# EAGLE design naked mega 4 rev1 (EAGLE 9.6.2)
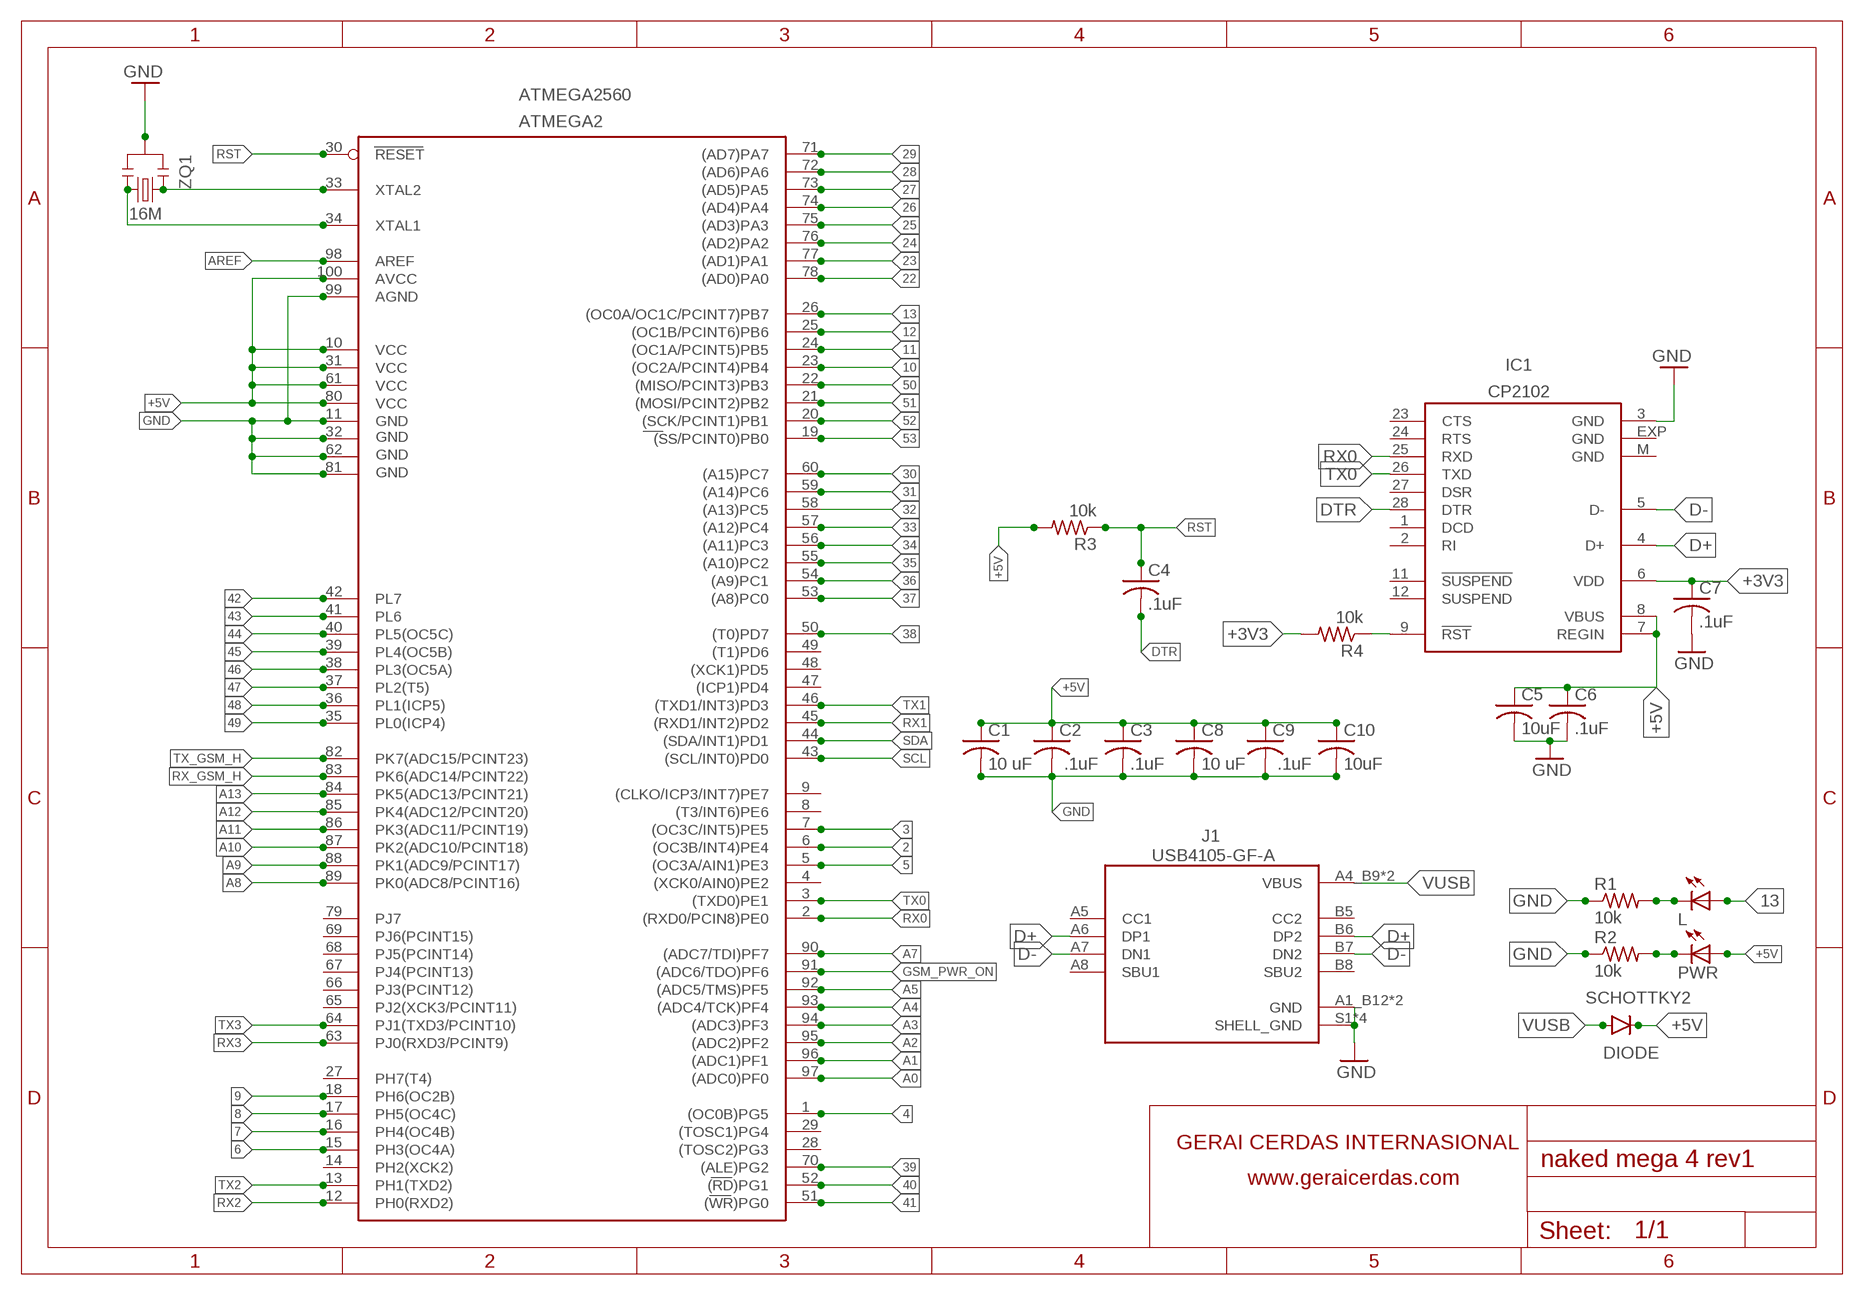
[diagram p0: schematic, sheet 1]

## Parts
ATMEGA2  ATMEGA2560  [TQFP100]
C1  10 uF  CAPACITOR-SMD-0805  [SMD-0805]
C2  .1uF  CAPACITOR-SMD-0805  [SMD-0805]
C3  .1uF  CAPACITOR-SMD-0805  [SMD-0805]
C4  .1uF  CAPACITOR-SMD-0805  [SMD-0805]
C5  10uF  CAPACITOR-SMD-0805  [SMD-0805]
C6  .1uF  CAPACITOR-SMD-0805  [SMD-0805]
C7  .1uF  CAPACITOR-SMD-0805  [SMD-0805]
C8  10 uF  CAPACITOR-SMD-0805  [SMD-0805]
C9  .1uF  CAPACITOR-SMD-0805  [SMD-0805]
C10  10uF  CAPACITOR-SMD-0805  [SMD-0805]
IC1  CP2102  [MLP28]
J1  USB4105-GF-A  [GCT_USB4105-GF-A]
L  L  LED-SMD-0805  [SMD-0805-LED]
PWR  L  LED-SMD-0805  [SMD-0805-LED]
R1  10k  RESISTOR-SMD-0805  [SMD-0805]
R2  10k  RESISTOR-SMD-0805  [SMD-0805]
R3  10k  RESISTOR-SMD-0805  [SMD-0805]
R4  10k  RESISTOR-SMD-0805  [SMD-0805]
SCHOTTKY2  DIODE  [SOD-323]
U$1  FRAME  [A4-HOR]
ZQ1  16M  RESONATORSMD-CSTCEXX  [CSTCE*]

## Nets
2: ATMEGA2.6((OC3B/INT4)PE4)
3: ATMEGA2.7((OC3C/INT5)PE5)
4: ATMEGA2.1((OC0B)PG5)
5: ATMEGA2.5((OC3A/AIN1)PE3)
6: ATMEGA2.15(PH3(OC4A))
7: ATMEGA2.16(PH4(OC4B))
8: ATMEGA2.17(PH5(OC4C))
9: ATMEGA2.18(PH6(OC2B))
10: ATMEGA2.23((OC2A/PCINT4)PB4)
11: ATMEGA2.24((OC1A/PCINT5)PB5)
12: ATMEGA2.25((OC1B/PCINT6)PB6)
13: ATMEGA2.26((OC0A/OC1C/PCINT7)PB7) L.1(A)
22: ATMEGA2.78((AD0)PA0)
23: ATMEGA2.77((AD1)PA1)
24: ATMEGA2.76((AD2)PA2)
25: ATMEGA2.75((AD3)PA3)
26: ATMEGA2.74((AD4)PA4)
27: ATMEGA2.73((AD5)PA5)
28: ATMEGA2.72((AD6)PA6)
29: ATMEGA2.71((AD7)PA7)
30: ATMEGA2.60((A15)PC7)
31: ATMEGA2.59((A14)PC6)
32: ATMEGA2.58((A13)PC5)
33: ATMEGA2.57((A12)PC4)
34: ATMEGA2.56((A11)PC3)
35: ATMEGA2.55((A10)PC2)
36: ATMEGA2.54((A9)PC1)
37: ATMEGA2.53((A8)PC0)
38: ATMEGA2.50((T0)PD7)
39: ATMEGA2.70((ALE)PG2)
40: ATMEGA2.52((RD)PG1)
41: ATMEGA2.51((WR)PG0)
42: ATMEGA2.42(PL7)
43: ATMEGA2.41(PL6)
44: ATMEGA2.40(PL5(OC5C))
45: ATMEGA2.39(PL4(OC5B))
46: ATMEGA2.38(PL3(OC5A))
47: ATMEGA2.37(PL2(T5))
48: ATMEGA2.36(PL1(ICP5))
49: ATMEGA2.35(PL0(ICP4))
50: ATMEGA2.22((MISO/PCINT3)PB3)
51: ATMEGA2.21((MOSI/PCINT2)PB2)
52: ATMEGA2.20((SCK/PCINT1)PB1)
53: ATMEGA2.19((SS/PCINT0)PB0)
+3V3: C7.1 IC1.6(VDD) R4.2
+5V: ATMEGA2.10(VCC) ATMEGA2.31(VCC1) ATMEGA2.61(VCC2) ATMEGA2.80(VCC3) ATMEGA2.100(AVCC) C1.1 C2.1 C3.1 C5.1 C6.1 C8.1 C9.1 C10.1 IC1.7(REGIN) IC1.8(VBUS) PWR.1(A) R3.2 SCHOTTKY2.C
A0: ATMEGA2.97((ADC0)PF0)
A1: ATMEGA2.96((ADC1)PF1)
A2: ATMEGA2.95((ADC2)PF2)
A3: ATMEGA2.94((ADC3)PF3)
A4: ATMEGA2.93((ADC4/TCK)PF4)
A5: ATMEGA2.92((ADC5/TMS)PF5)
A7: ATMEGA2.90((ADC7/TDI)PF7)
A8: ATMEGA2.89(PK0(ADC8/PCINT16))
A9: ATMEGA2.88(PK1(ADC9/PCINT17))
A10: ATMEGA2.87(PK2(ADC10/PCINT18))
A11: ATMEGA2.86(PK3(ADC11/PCINT19))
A12: ATMEGA2.85(PK4(ADC12/PCINT20))
A13: ATMEGA2.84(PK5(ADC13/PCINT21))
AREF: ATMEGA2.98(AREF)
D+: IC1.4(D+) J1.A6(DP1) J1.B6(DP2)
D-: IC1.5(D-) J1.A7(DN1) J1.B7(DN2)
DTR: C4.2 IC1.28(DTR)
GND: ATMEGA2.11(GND) ATMEGA2.32(GND1) ATMEGA2.62(GND2) ATMEGA2.81(GND3) ATMEGA2.99(AGND) C1.2 C2.2 C3.2 C5.2 C6.2 C7.2 C8.2 C9.2 C10.2 IC1.3(GND) J1.A1_B12(GND) J1.B1_A12(GND) J1.S1(SHELL_GND) J1.S2(SHELL_GND) J1.S3(SHELL_GND) J1.S4(SHELL_GND) R1.1 R2.1 ZQ1.2
GSM_PWR_ON: ATMEGA2.91((ADC6/TDO)PF6)
N$1: ATMEGA2.34(XTAL1) ZQ1.3
N$2: ATMEGA2.33(XTAL2) ZQ1.1
N$3: L.2(C) R1.2
N$4: IC1.9(!RST) R4.1
N$10: PWR.2(C) R2.2
RST: ATMEGA2.30(RESET) C4.1 R3.1
RX0: ATMEGA2.2((RXD0/PCIN8)PE0) IC1.25(RXD)
RX1: ATMEGA2.45((RXD1/INT2)PD2)
RX2: ATMEGA2.12(PH0(RXD2))
RX3: ATMEGA2.63(PJ0(RXD3/PCINT9))
RX_GSM_H: ATMEGA2.83(PK6(ADC14/PCINT22))
SCL: ATMEGA2.43((SCL/INT0)PD0)
SDA: ATMEGA2.44((SDA/INT1)PD1)
TX0: ATMEGA2.3((TXD0)PE1) IC1.26(TXD)
TX1: ATMEGA2.46((TXD1/INT3)PD3)
TX2: ATMEGA2.13(PH1(TXD2))
TX3: ATMEGA2.64(PJ1(TXD3/PCINT10))
TX_GSM_H: ATMEGA2.82(PK7(ADC15/PCINT23))
VUSB: J1.A4_B9(VBUS) J1.B4_A9(VBUS) SCHOTTKY2.A
Unconnected: ATMEGA2.4((XCK0/AIN0)PE2) ATMEGA2.8((T3/INT6)PE6) ATMEGA2.9((CLKO/ICP3/INT7)PE7) ATMEGA2.14(PH2(XCK2)) ATMEGA2.27(PH7(T4)) ATMEGA2.28((TOSC2)PG3) ATMEGA2.29((TOSC1)PG4) ATMEGA2.47((ICP1)PD4) ATMEGA2.48((XCK1)PD5) ATMEGA2.49((T1)PD6) ATMEGA2.65(PJ2(XCK3/PCINT11)) ATMEGA2.66(PJ3(PCINT12)) ATMEGA2.67(PJ4(PCINT13)) ATMEGA2.68(PJ5(PCINT14)) ATMEGA2.69(PJ6(PCINT15)) ATMEGA2.79(PJ7) IC1.1(DCD) IC1.2(RI) IC1.11(!SUSPEND) IC1.12(SUSPEND) IC1.23(CTS) IC1.24(RTS) IC1.27(DSR) J1.A5(CC1) J1.A8(SBU1) J1.B5(CC2) J1.B8(SBU2)

## Power pins joined to a net without a drawn wire
GND: IC1.EXP(GND) IC1.M(GND)

## Library data of the parts
ATMEGA2 = Fuzzy:ATMEGA2560
C1-C10 = Fuzzy:CAPACITOR-SMD-0805
IC1 = byquip:CP210*: Single-Chip USB to UART Bridge Source: www.silabs.com .. CP2101.pdf / cp2102.pdf; MF: FARNELL; MPN: CP2102-GM; OC_FARNELL: 9282130; OC_NEWARK: 30K5635
J1 = USB4105-GF-A:USB4105-GF-A: USB-C (USB TYPE-C) USB 2.0 Receptacle Connector 24 (16+8 Dummy) Position Surface Mount, Right Angle; Through Hole Check availability <https://pricing.snapeda.com/parts/USB4105-GF-A/GCT/view-part?ref=eda>; AVAILABILITY: In Stock; DESCRIPTION: USB-C (USB TYPE-C) USB 2.0 Receptacle Connector 24 (16+8 Dummy) Position Surface Mount, Right Angle; Through Hole; MF: GCT; MP: USB4105-GF-A; PACKAGE: None; PRICE: None; PURCHASE-URL: https://pricing.snapeda.com/search/part/USB4105-GF-A/?ref=eda
L PWR = Fuzzy:LED-SMD-0805
R1-R4 = Fuzzy:RESISTOR-SMD-0805
SCHOTTKY2 = Fuzzy:DIODE
U$1 = geraicerdas:FRAME
ZQ1 = geraicerdas:RESONATOR

## Board
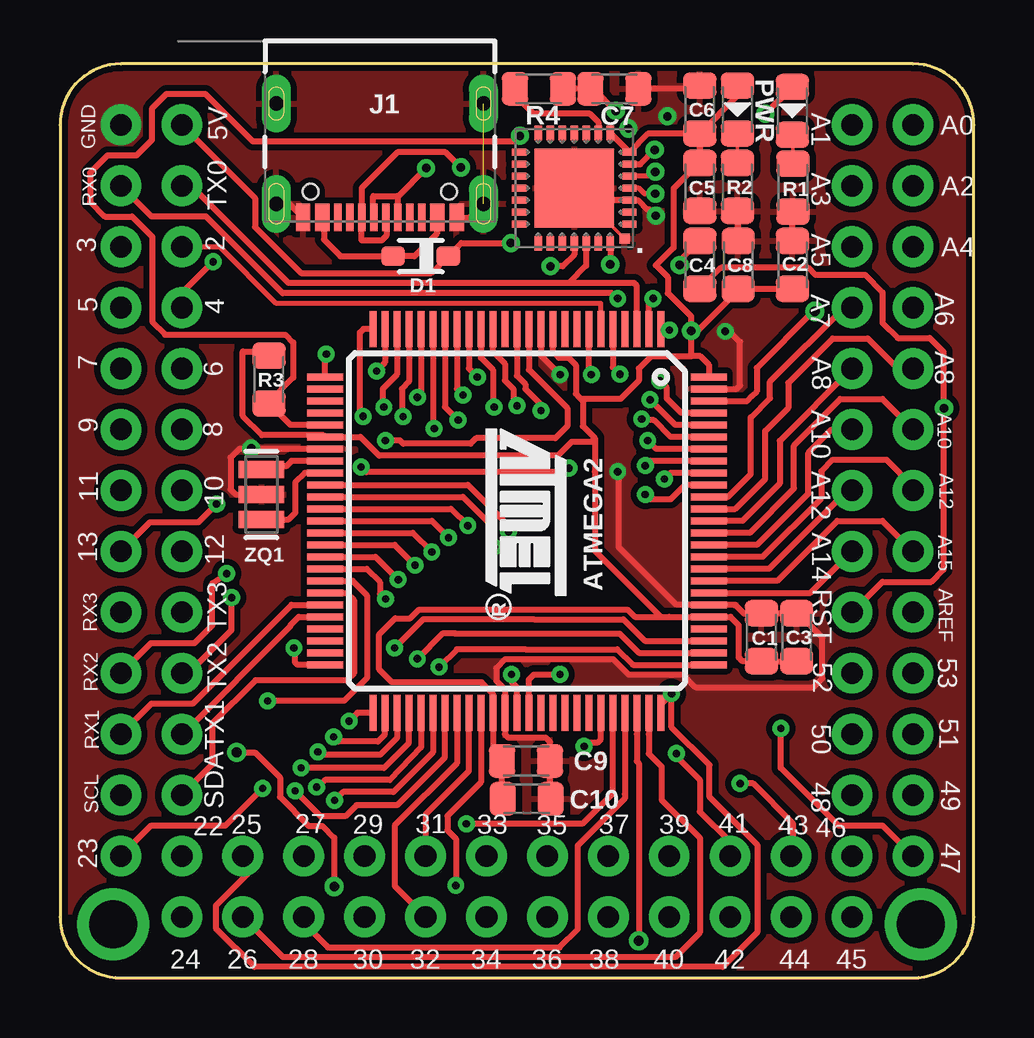
[diagram p1: board, top side]
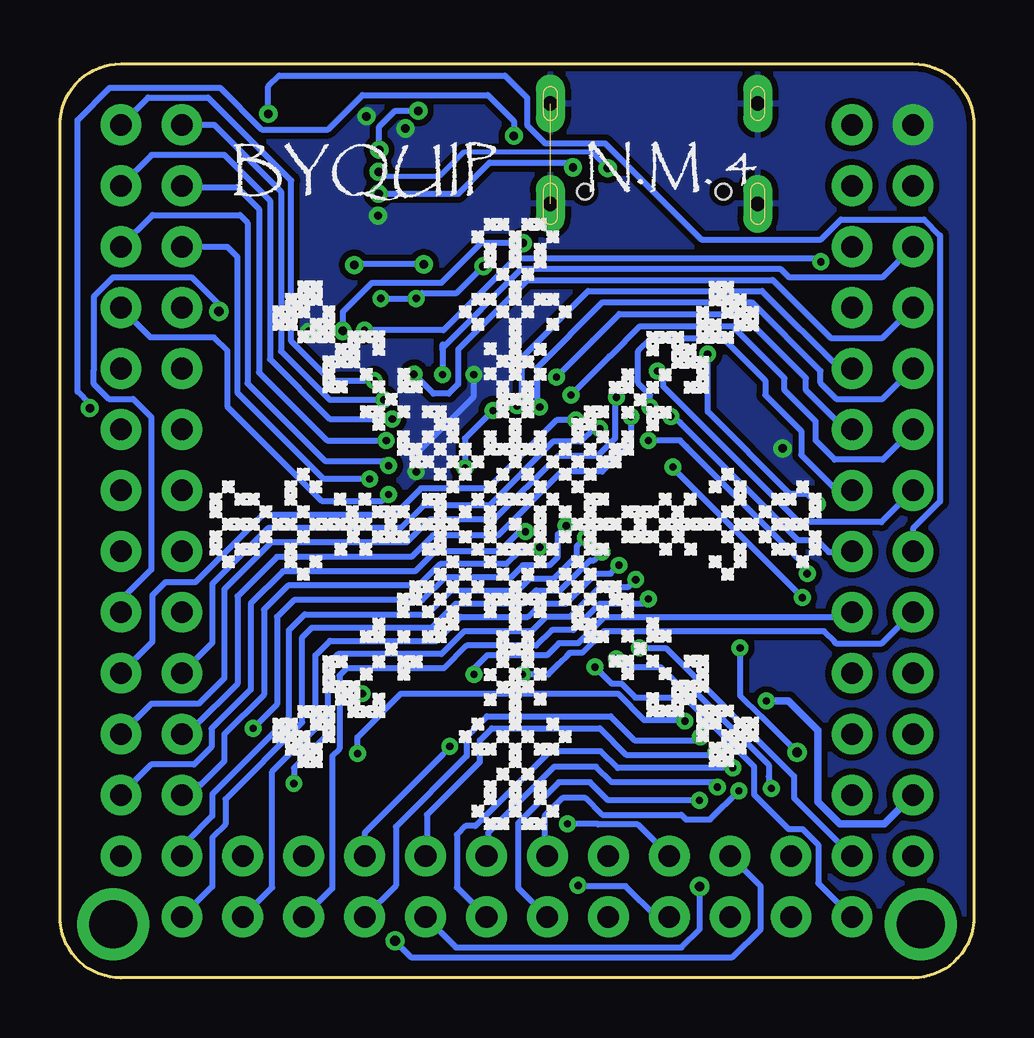
[diagram p2: board, bottom side, seen from below]

Size 38.1 x 38.1 mm. Coordinates in mm from the lower left corner, seen from the top.
Outline: 0,35.56 0,2.54 arc90 2.54,0 35.56,0 arc90 38.1,2.54 38.1,35.56 arc90 35.56,38.1 2.54,38.1 arc90 0,35.56
Copper layers (1*16): Top 0.035mm / dielectric 1.5mm / Bottom 0.035mm
Design rules "DFRobot_Eagle_Rule_v0.4": minimum track width 6mil, minimum drill 12mil, track to track 6mil, track to pad 6mil, pad to pad 6mil, via to via 6mil, smd to smd 0mil, copper to edge 10mil, drill to drill 10mil, minimum pad ring 12mil, minimum via ring 8mil, stop-mask expansion 2mil, vias tented up to drill 25mil, thermal gap 10mil

### Footprints (pad centres in the part's own frame; a part is rotated, then mirrored left to right if it is on the bottom)
TQFP100 = smd 1.5 x 0.3: 1 -8,6; 2 -8,5.5; 3 -8,5; 4 -8,4.5; 5 -8,4; 6 -8,3.5; 7 -8,3; 8 -8,2.5; 9 -8,2; 10 -8,1.5; 11 -8,1; 12 -8,0.5; 13 -8,0; 14 -8,-0.5; 15 -8,-1; 16 -8,-1.5; 17 -8,-2; 18 -8,-2.5; 19 -8,-3; 20 -8,-3.5; 21 -8,-4; 22 -8,-4.5; 23 -8,-5; 24 -8,-5.5; 25 -8,-6; 51 8,-6; 52 8,-5.5; 53 8,-5; 54 8,-4.5; 55 8,-4; 56 8,-3.5; 57 8,-3; 58 8,-2.5; 59 8,-2; 60 8,-1.5; 61 8,-1; 62 8,-0.5; 63 8,0; 64 8,0.5; 65 8,1; 66 8,1.5; 67 8,2; 68 8,2.5; 69 8,3; 70 8,3.5; 71 8,4; 72 8,4.5; 73 8,5; 74 8,5.5; 75 8,6 | smd 0.3 x 1.5: 26 -6,-8; 27 -5.5,-8; 28 -5,-8; 29 -4.5,-8; 30 -4,-8; 31 -3.5,-8; 32 -3,-8; 33 -2.5,-8; 34 -2,-8; 35 -1.5,-8; 36 -1,-8; 37 -0.5,-8; 38 0,-8; 39 0.5,-8; 40 1,-8; 41 1.5,-8; 42 2,-8; 43 2.5,-8; 44 3,-8; 45 3.5,-8; 46 4,-8; 47 4.5,-8; 48 5,-8; 49 5.5,-8; 50 6,-8; 76 6,8; 77 5.5,8; 78 5,8; 79 4.5,8; 80 4,8; 81 3.5,8; 82 3,8; 83 2.5,8; 84 2,8; 85 1.5,8; 86 1,8; 87 0.5,8; 88 0,8; 89 -0.5,8; 90 -1,8; 91 -1.5,8; 92 -2,8; 93 -2.5,8; 94 -3,8; 95 -3.5,8; 96 -4,8; 97 -4.5,8; 98 -5,8; 99 -5.5,8; 100 -6,8
SMD-0805 = smd 1.1 x 1.4: 1 -1,0; 2 1,0
MLP28 = smd 0.6 x 0.3: 1 -2.3,1.5; 2 -2.3,1; 3 -2.3,0.5; 4 -2.3,0; 5 -2.3,-0.5; 6 -2.3,-1; 7 -2.3,-1.5; 15 2.3,-1.5; 16 2.3,-1; 17 2.3,-0.5; 18 2.3,0; 19 2.3,0.5; 20 2.3,1; 21 2.3,1.5 | smd 0.3 x 0.6: 8 -1.5,-2.3; 9 -1,-2.3; 10 -0.5,-2.3; 11 0,-2.3; 12 0.5,-2.3; 13 1,-2.3; 14 1.5,-2.3; 22 1.5,2.3; 23 1,2.3; 24 0.5,2.3; 25 0,2.3; 26 -0.5,2.3; 27 -1,2.3; 28 -1.5,2.3 | smd 3.3 x 3.3: EXP 0,0 | smd 0.435 x 0.435: M -2.103,2.103
GCT_USB4105-GF-A = smd 0.6 x 1.15: A1_B12 -3.2,4.755; A4_B9 -2.4,4.755; B1_A12 3.2,4.755; B4_A9 2.4,4.755 | smd 0.3 x 1.15: A5 -1.25,4.755; A6 -0.25,4.755; A7 0.25,4.755; A8 1.25,4.755; B5 1.75,4.755; B6 0.75,4.755; B7 -0.75,4.755; B8 -1.75,4.755 | drill 0.6 pad 1.05 long: S1 -4.32,4.18; S4 4.32,4.18 | drill 0.6 pad 1 long: S2 -4.32,0; S3 4.32,0 | hole 0.65: 2.89,3.68; -2.89,3.68
SMD-0805-LED = smd 1.1 x 1.4: 1 -1,0; 2 1,0
SOD-323 = smd 1 x 0.8: A 1.15,0; C -1.15,0
CSTCE* = smd 0.7 x 1.905: 1 -1.041,0; 2 0,0; 3 1.041,0

### Placement (x,y rotation side)
ATMEGA2  19.05,19.05 270 top
C1  29.24,14.2 90 top
C2  30.54,29.72 90 top
C3  30.71,14.2 90 top
C4  26.67,29.72 90 top
C5  26.67,32.97 270 top
C6  26.67,36.2 90 top
C7  23.11,37.06 0 top
C8  28.27,29.72 90 top
C9  19.43,9.04 0 top
C10  19.46,7.47 0 top
IC1  21.44,32.92 180 top
J1  13.33,36.45 180 top
L  30.53,36.14 270 top
PWR  28.24,36.2 270 top
R1  30.56,32.94 90 top
R2  28.24,32.97 90 top
R3  8.71,24.94 90 top
R4  19.96,37.06 0 top
SCHOTTKY2  15.04,30.09 180 top
U$1  -0.25,-0.13 0 top
U$4  [RUBIZHNE-VYSHYVANKA-LOGO]  6.38,6.17 0 top
ZQ1  8.4,20.15 270 top

### Tracks (layer width: path | path; a pad name or v marks a point on that pad's centre or on a via)
2  (via drill 0.9 pad 1.7)
  Top 0.2: ATMEGA2.6 22.55,28.11 9.02,28.11 6.65,30.48 v5.08,30.48
3  (via drill 0.3 pad 0.5, 0.9 pad 1.7)
  Top 0.25: ATMEGA2.7 22.05,25.25 v22.15,25.15
  Bottom 0.25: 7.7,29.2 3.82,29.2 v2.54,30.48 | 22.05,25.25 v22.15,25.15 22.15,26.16 22.15,26.4
  Bottom 0.254: 7.7,29.2 8.04,29.54 18.87,29.54 22.15,26.26 22.15,26.16
4  (via drill 0.3 pad 0.5, 0.9 pad 1.7)
  Top 0.25: v25.4,27 25.1,27 ATMEGA2.1
  Top 0.254: v5.08,27.94 5.08,28.54 v6.39,29.85
  Bottom 0.25: v25.4,27 22.11,27 19.14,29.97
  Bottom 0.254: 19.14,29.97 6.39,29.97 v6.39,29.85
5  (via drill 0.3 pad 0.5, 0.9 pad 1.7)
  Top 0.25: ATMEGA2.5 23.05,26.05
  Top 0.254: 23.05,26.05 23.05,25.46 v23.35,25.16
  Bottom 0.25: 21.9,24.35 21.5,24.75 21.5,26.2 18.61,29.09 8.39,29.09 5.97,26.67 3.81,26.67 v2.54,27.94
  Bottom 0.254: 21.9,24.35 22.53,24.35 v23.35,25.16
6  (via drill 0.3 pad 0.5, 0.9 pad 1.7)
  Top 0.25: v19.05,23.85 18.9,24 18.9,24.55 18.55,24.9 18.55,25.6 18.05,26.1 ATMEGA2.15
  Bottom 0.25: v5.08,25.4 5.6,25.4 8.83,28.63 16.08,28.63 18.85,25.86 18.85,24.05 v19.05,23.85
7  (via drill 0.3 pad 0.5, 0.9 pad 1.7)
  Top 0.25: ATMEGA2.16 17.55,25.85 18.05,25.35 18.05,23.85 v18.1,23.8
  Bottom 0.25: v18.1,23.8 18.2,23.9 18.2,25.45 15.48,28.17 9.27,28.17 6.4,25.3 6.4,24.8 5.73,24.13 3.81,24.13 v2.54,25.4
8  (via drill 0.3 pad 0.5, 0.9 pad 1.7)
  Top 0.25: ATMEGA2.17 17.05,25.4 v17.4,25.05
  Bottom 0.25: v5.08,22.86 5.36,22.86 7,24.5 7,25 9.68,27.68 14.78,27.68 15.89,26.57 15.89,26.56 v17.4,25.05
9  (via drill 0.3 pad 0.5, 0.9 pad 1.7)
  Top 0.25: ATMEGA2.18 16.55,24.55 v16.8,24.3
  Bottom 0.25: v16.8,24.3 15.2,25.9 15.18,25.9 13.91,27.17 10.07,27.17 7.9,25 7.9,24.5 6.6,23.2 6.6,22.4 5.8,21.6 3.8,21.6 v2.54,22.86
10  (via drill 0.3 pad 0.5, 0.9 pad 1.7)
  Top 0.25: ATMEGA2.23 14.05,25.15 13.45,24.55 13.45,23.85 v13.5,23.8
  Bottom 0.25: v13.5,23.8 13.5,24.3 14,24.8 14,26.12 13.45,26.67 10.47,26.67 8.7,24.9 8.7,24.3 7.2,22.8 7.2,21.8 5.7,20.3 5.1,20.3 v5.08,20.32
11  (via drill 0.3 pad 0.5, 0.9 pad 1.7)
  Top 0.25: ATMEGA2.24 13.55,25.65 v13.2,25.3 13.15,25.35
  Bottom 0.25: v13.2,25.3 12.95,25.05 12.95,24.65 7.3,19 3.86,19 v2.54,20.32
12  (via drill 0.3 pad 0.5, 0.9 pad 1.7)
  Top 0.25: ATMEGA2.25 12.65,27.05 12.5,26.9 12.5,23.3
  Top 0.254: v12.64,23.41 12.5,23.29 12.5,23.3
  Bottom 0.25: 12.05,22.95 7.35,18.25 6.55,18.25 6.05,17.75 5.11,17.75 v5.08,17.78
  Bottom 0.254: 12.05,22.95 12.25,23.15 v12.64,23.41
13  (via drill 0.3 pad 0.5, 0.35, 0.9 pad 1.7)
  Top 0.25: v2.54,17.78 3.76,19 5.77,19 v6.52,19.75 | ATMEGA2.26 11.05,25.95 v11.1,26 | L.1 30.53,37.14 v29.41,36.02
  Bottom 0.25: 11.2,25.9 v11.1,26 11.1,23.6 7.7,20.2 6.97,20.2 v6.52,19.75 | v29.41,36.02 29.41,37.16 28.96,37.62 19.56,37.62 18.63,36.69 18.63,35.55 17.88,34.79 15.38,34.79 11.36,30.78 6.37,30.78 5.55,31.61 2.07,31.61 1.41,30.95 1.41,19.85 2.54,18.73 v2.54,17.78
22  (via drill 0.3 pad 0.5, 0.9 pad 1.7)
  Top 0.25: 24.38,14.05 ATMEGA2.78 | 19.75,14.95 15.65,14.95
  Top 0.254: 19.75,14.95 23.48,14.95 24.38,14.05 | 15.65,14.95 15.14,14.95 v13.94,13.75
  Bottom 0.25: v13.94,13.75 12.85,13.75 | 7.5,8.38 7.5,7.5 v5.08,5.08
  Bottom 0.254: 12.85,13.75 7.5,8.4 7.5,8.38
23  (via drill 0.3 pad 0.5, 0.9 pad 1.7)
  Top 0.25: 24.13,13.55 ATMEGA2.77 | 16.45,14.35 16.51,14.35 19.5,14.35 | v2.54,5.08 3.81,6.35 6.9,6.35 v8.45,7.9
  Top 0.254: 19.5,14.35 23.33,14.35 24.13,13.55 | 16.51,14.35 15.94,14.35 v14.9,13.3
  Bottom 0.25: 8.55,8.38 8.55,8 v8.45,7.9
  Bottom 0.254: 8.55,8.38 8.55,8.87 11.77,12.09 12.19,12.09 13.05,12.95 14.54,12.95 v14.9,13.3
24  (via drill 0.3 pad 0.5, 0.9 pad 1.7)
  Top 0.25: 23.88,13.05 ATMEGA2.76 | 19.4,13.7 16.55,13.7
  Top 0.254: 19.4,13.7 23.23,13.7 23.88,13.05 | 16.55,13.7 16.54,13.7 v15.8,12.95
  Bottom 0.254: v5.08,2.54 6.49,3.95 6.49,5.55 7.15,6.21 7.73,6.21 9.17,7.64 9.17,8.81 11.94,11.58 11.94,11.68 14.11,11.68 14.68,12.25 15.1,12.25 v15.8,12.95
25  (via drill 0.3 pad 0.5, 0.9 pad 1.7)
  Top 0.25: ATMEGA2.75 25.05,11.4 v25.5,11.85
  Top 0.254: v25.5,11.85 25.5,10.45 27.07,8.87 27.07,7.54 29.07,5.55 29.07,1.89 27.63,0.46 8.11,0.46 6.49,2.07 6.49,3.01 8.09,4.61 v7.62,5.08
26  (via drill 0.9 pad 1.7)
  Top 0.25: ATMEGA2.74 24.55,10.16
  Top 0.254: v7.62,2.54 9.3,0.86 25.65,0.86 26.67,1.88 26.67,5.84 25.08,7.43 25.08,8.81 24.55,9.34 24.55,10.16
27  (via drill 0.4, 0.9 pad 1.7)
  Top 0.25: ATMEGA2.73 24.05,10.16
  Top 0.254: v24.13,1.55 24.13,8.95 24.05,9.03 24.05,10.16
  Bottom 0.254: 24.13,1.52 v24.13,1.55 | 23.88,1.27 arc90 24.13,1.52 | 23.88,1.27 24.13,1.52 | 23.88,1.27 23.47,0.86 10.06,0.86 8.89,2.03 8.89,3.81 v10.16,5.08
28  (via drill 0.9 pad 1.7)
  Top 0.25: ATMEGA2.72 23.55,7.66 23.55,7.48
  Top 0.254: v10.16,2.54 10.16,2.29 11.18,1.27 20.83,1.27 21.59,2.03 21.59,5.52 23.55,7.48
29  (via drill 0.3 pad 0.5, 0.9 pad 1.7)
  Top 0.25: ATMEGA2.71 23.05,7.69 21.78,6.42 v16.94,6.42
  Bottom 0.254: v12.7,5.08 14.02,6.4 15.67,6.4 15.69,6.42 v16.94,6.42
30  (via drill 0.3 pad 0.5, 0.9 pad 1.7)
  Top 0.25: 16.45,3.9 v16.5,3.85 16.5,5.8 16.15,6.15 16.15,6.75 17.55,8.15 ATMEGA2.60
  Bottom 0.25: v12.7,2.54 13.24,2.54 14.52,3.82 16.47,3.82 v16.5,3.85
31  (via drill 0.9 pad 1.7)
  Top 0.25: 15.2,5.12 v15.24,5.08 15.24,6.81 17.05,8.62 ATMEGA2.59
32  (via drill 0.9 pad 1.7)
  Top 0.25: ATMEGA2.58 16.55,8.95 13.95,6.35 13.95,3.83 v15.24,2.54
33  (via drill 0.3 pad 0.5, 0.9 pad 1.7)
  Top 0.25: ATMEGA2.57 16.05,9.2 14.05,7.2 12.36,7.2 11.9,6.74 10.86,6.74 v9.8,7.8
  Bottom 0.25: v17.78,5.08 17.9,5.2 17.9,6.75 17.15,7.5 16.2,7.5 15.5,6.8 12.2,6.8 12,6.6 11,6.6 v9.8,7.8
34  (via drill 0.3 pad 0.5, 0.9 pad 1.7)
  Top 0.25: ATMEGA2.56 15.55,9.4 13.9,7.75 11.8,7.75 v11.45,7.4 11.5,7.45
  Bottom 0.25: v11.45,7.4 15.25,7.4 16,8.15 17.3,8.15 19,6.45 19,3.76 v17.78,2.54
35  (via drill 0.3 pad 0.5, 0.9 pad 1.7)
  Top 0.25: ATMEGA2.55 15.05,9.6 13.75,8.25 11.05,8.25 v10.7,7.95
  Bottom 0.25: v20.32,5.08 20.25,5.15 20.25,6.05 17.5,8.8 15.75,8.8 15.1,8.15 10.9,8.15 v10.7,7.95
36  (via drill 0.3 pad 0.5, 0.9 pad 1.7)
  Top 0.25: v10.05,8.75 13.5,8.75 14.55,9.8 ATMEGA2.54
  Bottom 0.25: v10.05,8.75 14.85,8.75 15.55,9.45 17.7,9.45 17.7,9.41 20.78,6.33 21.19,6.33 21.55,5.97 21.55,3.77 v20.32,2.54
37  (via drill 0.3 pad 0.5, 0.9 pad 1.7)
  Top 0.25: ATMEGA2.53 14.05,10 13.35,9.3 10.95,9.3 v10.75,9.42
  Bottom 0.25: v22.86,5.08 22.8,5.14 22.8,6.8 20.6,9 20.6,9.9 20.1,10.4 15.6,10.4 14.5,9.3 10.95,9.3 v10.75,9.42
38  (via drill 0.3 pad 0.5, 0.4, 0.9 pad 1.7)
  Top 0.25: ATMEGA2.50 9.9,13.05 9.8,13.15 9.8,13.7 v9.75,13.75
  Top 0.254: v7.37,9.4 8.13,9.4 9.17,8.36 9.17,7.54 10.37,6.33 10.94,6.33 11.43,5.84 v11.43,3.81
  Bottom 0.254: v7.37,9.4 8.89,10.92 8.91,10.92 9.75,11.76 v9.75,13.75 | v22.86,2.54 21.59,1.27 12.19,1.27 11.43,2.03 v11.43,3.81
39  (via drill 0.3 pad 0.5, 0.9 pad 1.7)
  Top 0.25: v21.85,9.65 22,9.8 22.4,9.8 22.55,9.95 ATMEGA2.70
  Bottom 0.25: v21.85,9.65 22.15,9.3 25.4,6.05 v25.4,5.08
40  (via drill 0.3 pad 0.5, 0.9 pad 1.7)
  Top 0.25: v11.4,10.05 11.6,9.85 13.25,9.85 13.55,10.15 ATMEGA2.52
  Bottom 0.25: v25.4,2.54 24.1,3.84 24.1,6.3 21.15,9.25 21.15,10.05 20.3,10.9 15.15,10.9 14.15,9.9 11.55,9.9 v11.4,10.05
41  (via drill 0.3 pad 0.5, 0.9 pad 1.7)
  Top 0.25: ATMEGA2.51 12.4,11.05 v12.05,10.7 | v27.94,5.08 27.94,5.66 26.67,6.93 26.67,8.26 25.7,9.23 v25.7,9.35
  Bottom 0.25: v12.05,10.7 12.1,10.75 13.75,10.75 14.85,11.85 23.88,11.85 | 25.6,9.45 v25.7,9.35
  Bottom 0.254: v25.7,9.35 25.7,10.03 23.88,11.85
42  (via drill 0.3 pad 0.5, 0.9 pad 1.7)
  Top 0.25: ATMEGA2.42 12.79,17.05 13.34,16.5 13.34,16.02 v13.57,15.79
  Bottom 0.25: v27.94,2.54 26.75,3.73 26.75,9.25 26.45,9.55 26.45,12.6 26.15,12.9 22.1,12.9 21.15,13.85 18.25,13.85 17.6,14.5 16.7,14.5 15.6,15.6 13.76,15.6 v13.57,15.79
43  (via drill 0.3 pad 0.5, 0.9 pad 1.7)
  Top 0.25: ATMEGA2.41 13.15,17.55 v14.1,16.6 14.05,16.65 | v30.48,5.08 30.55,5.15 30.55,6.45 28.9,8.1 v28.35,8.1
  Bottom 0.25: v28.35,8.1 28.35,8.75 26.95,10.15 26.95,13.05 26.5,13.5 22.2,13.5 21.25,14.45 18.45,14.45 17.85,15.05 16.85,15.05 15.6,16.3 14.4,16.3 v14.1,16.6
44  (via drill 0.3 pad 0.5, 0.9 pad 1.7)
  Top 0.25: ATMEGA2.40 13.95,18.05 v14.8,17.2 14.75,17.25
  Bottom 0.25: v14.8,17.2 15.15,16.85 15.75,16.85 17,15.6 18.05,15.6 18.6,15.05 21.4,15.05 22.4,14.05 26.85,14.05 27.45,13.45 27.45,10.4 29.25,8.6 29.25,3.77 v30.48,2.54
45  (via drill 0.3 pad 0.5, 0.9 pad 1.7)
  Top 0.25: ATMEGA2.39 14.7,18.55 v15.5,17.75
  Bottom 0.25: v33.02,2.54 31.75,3.81 31.75,5.85 31.2,6.4 31.2,7.45 28,10.65 28,14.2 27.6,14.6 22.6,14.6 21.6,15.6 18.8,15.6 18.25,16.15 17.25,16.15 16,17.4 15.85,17.4 v15.5,17.75
46  (via drill 0.3 pad 0.5, 0.9 pad 1.7)
  Top 0.25: ATMEGA2.38 15.5,19.05 v16.2,18.35
  Bottom 0.25: 32.9,5.2 v33.02,5.08 32.8,5.3 32.8,5.7 31.75,6.75 31.75,7.65 28.55,10.85 28.55,14.5 27.9,15.15 22.8,15.15 21.8,16.15 19,16.15 18.5,16.65 17.5,16.65 16.55,17.6 16.55,18 v16.2,18.35
47  (via drill 0.3 pad 0.5, 0.9 pad 1.7)
  Top 0.25: ATMEGA2.37 16.3,19.55 v17,18.85 | v35.56,5.08 34.29,6.35 32.45,6.35 30.05,8.75 v30.05,10.4
  Bottom 0.25: v30.05,10.4 29.05,11.4 29.05,15.05 28.35,15.75 23,15.75 22.05,16.7 19.3,16.7 18.8,17.2 17.7,17.2 17.35,17.55 17.35,18.5 v17,18.85
48  (via drill 0.3 pad 0.5, 0.9 pad 1.7)
  Top 0.25: ATMEGA2.36 16.8,20.05 17.95,18.9 17.95,18.1 v18.1,17.95
  Bottom 0.25: v18.1,17.95 18.25,17.8 18.95,17.8 19.5,17.25 22.25,17.25 23.15,16.35 28.6,16.35 29.6,15.35 29.6,11.8 31.25,10.15 31.25,9.03 32.24,8.04 32.6,8.04 v33.02,7.62
49  (via drill 0.3 pad 0.5, 0.9 pad 1.7)
  Top 0.25: ATMEGA2.35 17,20.55 18.45,19.1 18.45,18.85 v18.7,18.6
  Bottom 0.25: v18.7,18.6 18.95,18.6 19.75,17.8 22.45,17.8 23.3,16.95 28.8,16.95 30.15,15.6 30.15,12.02 31.78,10.39 31.78,9.62 32.51,8.89 34.29,8.89 v35.56,7.62
50  (via drill 0.3 pad 0.5, 0.9 pad 1.7)
  Top 0.25: ATMEGA2.22 14.55,24.85 14.25,24.55 14.25,23.45 v14.3,23.4
  Bottom 0.25: v14.3,23.4 14.3,22.3 15.5,21.1 17.2,21.1 19.85,18.45 22.55,18.45 23.45,17.55 29.05,17.55 30.7,15.9 30.7,12.26 32.5,10.46 32.72,10.46 v33.02,10.16
51  (via drill 0.3 pad 0.5, 0.9 pad 1.7)
  Top 0.25: 15,24.3 v14.9,24.2 15.05,24.35 ATMEGA2.21
  Bottom 0.25: 35.54,10.16 v35.56,10.16 34.29,11.43 34.28,11.42 32.32,11.42 31.25,12.49 31.25,16.2 29.3,18.15 23.65,18.15 22.7,19.1 20,19.1 17.35,21.75 15.7,21.75 14.95,22.5 14.95,24.15 v14.9,24.2
52  (via drill 0.3 pad 0.5, 0.9 pad 1.7)
  Top 0.25: 15.5,23 v15.6,22.9 15.55,22.95 ATMEGA2.20
  Bottom 0.25: v15.6,22.9 15.85,22.9 16.4,22.35 17.55,22.35 20.2,19.7 22.95,19.7 23.9,18.75 29.43,18.75 31.75,16.43 31.75,13.97 v33.02,12.7
53  (via drill 0.3 pad 0.5, 0.9 pad 1.7)
  Top 0.25: ATMEGA2.19 16.05,23.8 v16.6,23.25
  Bottom 0.25: v16.6,23.25 17.4,23.25 20.25,20.4 23.05,20.4 24.15,19.3 29.66,19.3 32.47,16.49 33.71,16.49 34.25,15.95 34.25,14.01 v35.56,12.7
+3V3  (via drill 0.35)
  Top 0.25: R4.2 C7.1 22.25,37.06 v23.16,36.14 | IC1.6 24.19,33.92 v24.79,34.52
  Bottom 0.25: v23.16,36.14 24.13,36.14 24.79,35.48 v24.79,34.52
+5V  (via drill 0.35, 0.9 pad 1.7)
  Top 0.152: 18.05,9.42 C9.1
  Top 0.25: 25.4,15.05 25.05,15.05 22.3,17.8 22.3,21.1 | 20.55,26.1 20.8,25.85 21.2,25.85 21.5,25.55 21.5,24.35 21.65,24.2 21.8,24.05 21.8,23 22,22.8 | 27.95,15.05 28.3,14.7 28.3,13.35 28.45,13.2 C1.1 C3.1 | 27.05,25.56 26.7,25.91 26.32,25.91 26.31,25.91 v26.31,26.98 | 5.1,35.54 v5.08,35.56 8.13,32.51 8.13,31.3 10.04,29.39 15.49,29.39 SCHOTTKY2.C 16.73,30.63 v18.8,30.63 | ATMEGA2.61 18.05,9.42 | C5.1 C6.1 28.24,36.77 PWR.1 | IC1.8 IC1.7 24.5,35.18 26.67,35.18 C5.1 | v26.31,26.98 26.59,26.98 28.27,28.65 C8.1 C2.1 | ATMEGA2.31 10.98,22.62 8.43,22.62 7.62,23.43 7.62,26.11 8.54,26.11 R3.2 | v26.31,26.98 26.31,27.57 25.34,28.54 25.34,29.21 24.84,29.7 25.58,30.44 25.58,32.9 26.64,33.97 C5.1 | C10.1 18.43,7.49 C9.1
  Top 0.254: 22.3,22.5 22,22.8 | 22.3,22.5 22.3,21.1 | 21.65,24.2 21.72,24.13 23.37,24.13 24.13,24.89 24.13,25.4 24.64,25.91 26.31,25.91 | 22.3,22.5 22.15,22.35 21.34,22.35 20.76,21.77 13.3,21.77 12.53,22.55 ATMEGA2.31 | 20.55,26.1 ATMEGA2.10 | 27.05,25.56 ATMEGA2.100 | ATMEGA2.61 18.05,11.85 17.57,12.32 13.84,12.32 13.31,12.85 13.31,14.33 13.97,14.99 14.6,14.99 14.97,15.36 23.65,15.36 23.96,15.05 25.4,15.05 ATMEGA2.80 27.95,15.05 | 5.12,35.56 5.1,35.54
  Bottom 0.25: v18.8,30.63 20.55,30.63 22.2,28.98 25.09,28.98 26.31,27.76 v26.31,26.98
A0  (via drill 0.3 pad 0.5, 0.9 pad 1.7)
  Top 0.25: ATMEGA2.97 25.9,23.55 25.3,24.15 25.3,24.6 v25,24.9
  Bottom 0.25: v35.56,35.56 34.42,36.7 31.93,36.7 28.46,33.23 28.46,26.54 26.81,24.89 v25.01,24.89 v25,24.9
A1  (via drill 0.3 pad 0.5, 0.9 pad 1.7)
  Top 0.25: ATMEGA2.96 25.65,23.05 v24.6,24.1
  Bottom 0.25: v33.02,35.56 31.67,35.56 28.89,32.78 28.89,26.13 26.86,24.1 v24.6,24.1 v24.61,24.09
A2  (via drill 0.3 pad 0.5, 0.9 pad 1.7)
  Top 0.25: ATMEGA2.95 25.45,22.55 24.75,23.25 24.3,23.25 v24.25,23.3
  Bottom 0.25: v35.56,33.02 34.28,34.3 31.24,34.3 29.34,32.41 29.34,25.79 26.86,23.3 v24.25,23.3
A3  (via drill 0.3 pad 0.5, 0.9 pad 1.7)
  Top 0.25: ATMEGA2.94 24.85,22.05 v24.5,22.4
  Bottom 0.25: v33.02,33.02 32.97,32.97 30.72,32.97 29.8,32.05 29.8,25.24 26.96,22.4 v24.5,22.4
A4  (via drill 0.3 pad 0.5, 0.9 pad 1.7)
  Top 0.25: ATMEGA2.93 24.45,21.55 v24.4,21.35
  Bottom 0.25: v35.56,30.48 34.24,31.8 30.6,31.8 30.28,31.48 30.28,24.78 ATMEGA2.93 24.6,21.55 v24.4,21.35
A5  (via drill 0.3 pad 0.5, 0.9 pad 1.7)
  Top 0.25: 25.4,21 v25.2,20.8 25.45,21.05 ATMEGA2.92
  Bottom 0.25: v33.02,30.48 31.13,30.48 30.71,30.06 30.71,24.4 27.11,20.8 v25.2,20.8
A7  (via drill 0.9 pad 1.7)
  Top 0.25: ATMEGA2.90 27.85,20.05 28.8,21 28.8,23.36 29.6,24.16 29.6,24.86 32.67,27.93 33.01,27.93 v33.02,27.94
A8  (via drill 0.9 pad 1.7)
  Top 0.25: ATMEGA2.89 28.15,19.55 29.4,20.8 29.4,22.8 30.36,23.76 30.36,24.8 32.21,26.65
  Top 0.254: 32.21,26.65 33.67,26.65 34.92,25.4 v35.56,25.4
A9  (via drill 0.9 pad 1.7)
  Top 0.25: v33.02,25.4 30,22.38 30,20.6 28.45,19.05 ATMEGA2.88
A10  (via drill 0.9 pad 1.7)
  Top 0.25: v35.56,22.86 34.29,24.13 32.53,24.13 30.6,22.2 30.6,20.4 28.75,18.55 ATMEGA2.87
A11  (via drill 0.9 pad 1.7)
  Top 0.25: ATMEGA2.86 29.05,18.05 31.2,20.2 31.2,21.89 32.16,22.85 33.01,22.85 v33.02,22.86
A12  (via drill 0.9 pad 1.7)
  Top 0.25: v35.56,20.32 35.56,20.49 34.45,21.6 32.22,21.6 31.73,21.11 31.73,19.99 29.29,17.55 ATMEGA2.85
A13  (via drill 0.9 pad 1.7)
  Top 0.25: v33.02,20.32 32.7,20 32.5,20 29.55,17.05 ATMEGA2.84
AREF  (via drill 0.4, 0.9 pad 1.7)
  Top 0.25: ATMEGA2.98 28.65,24.05 28.84,24.24
  Top 0.254: v31.47,27.79 31.41,27.79 29.05,25.43 29.05,24.45 28.84,24.24
  Bottom 0.254: v35.56,15.24 35.56,15.75 34.29,17.02 34.29,23.37 35.05,24.13 36.07,24.13 36.69,24.75 36.69,25.35 36.69,28.41 35.89,29.21 32.61,29.21 31.47,28.07 v31.47,27.79
D+  (via drill 0.35)
  Top 0.152: J1.A6 13.61,31.66 | 12.57,31.68 J1.B6
  Top 0.2: v24.82,32.69 24.37,32.69 24.14,32.92 IC1.4
  Top 0.25: 13.61,31.66 13.61,30.94 13.41,30.73 12.57,30.73 12.57,31.68 | J1.B6 12.58,32.93 14.07,34.42 16.08,34.42 v16.71,33.78
  Bottom 0.25: v16.71,33.78 16.92,33.99 20.19,33.99 21.49,32.69 v24.82,32.69
D-  (via drill 0.35)
  Top 0.152: J1.A7 13.06,31.72 | 14.08,32.58 14.07,32.59
  Top 0.2: v24.82,33.6 24.64,33.43 23.75,33.43 IC1.5
  Top 0.25: 13.06,31.72 13.06,32.59 14.07,32.59 | J1.B7 14.08,32.58 v15.27,33.76
  Bottom 0.2: v15.27,33.76 15.93,34.42 21.28,34.42 22.28,33.43 24.64,33.43 v24.82,33.6
DTR  (via drill 0.35)
  Top 0.25: IC1.28 v22.94,29.75 v22.94,29.74 | v25.83,29.72 25.83,29.88 C4.2
  Bottom 0.25: v22.94,29.74 25.81,29.74 v25.83,29.72
GND  (via drill 0.3 pad 0.5, 0.35, 0.9 pad 1.7)  (1 unrouted)
  Top 0.152: ZQ1.2 8.4,20.33 | IC1.M IC1.EXP 21.44,32.95
  Top 0.25: ATMEGA2.99 28.2,24.55 28.35,24.7 28.35,26.51 27.91,26.95 v27.73,26.95 | v23.25,21.1 23.3,21.05 23.3,17.95 25.7,15.55 ATMEGA2.81 28.15,15.55 28.5,15.2 C1.2 C3.2 30.77,15.2 31.79,14.19 31.79,12.49 31.41,12.12 | ATMEGA2.11 20.05,25.95 v20.85,25.15 | ATMEGA2.62 18.55,10.15 18.68,10.02 20.24,10.02 20.43,9.83 C9.2 20.43,7.49 C10.2 | R2.1 28.27,31.94 C8.2 28.07,30.92 | C2.2 30.54,31.93 R1.1 | IC1.EXP 21.87,32.92 22.37,32.42 IC1.3 24.11,32.42 24.49,32.03 24.58,32.03 v24.84,31.78 | C6.2 26.53,37.06 C7.2 | ATMEGA2.32 7.47,22.05 7.11,21.69 7.11,20.36 7.32,20.15 ZQ1.2 | J1.A1_B12 17.08,31.69 J1.S1 | J1.S4 9.56,32.27 J1.B1_A12
  Top 0.254: ATMEGA2.62 18.55,12.03 18.19,12.38 18.19,12.91 18.56,13.28 23.07,13.28 23.71,12.64 24.04,12.64 24.05,12.65 25.96,12.65 26.49,12.12 31.41,12.12
  Bottom 0.25: v23.25,21.1 23.25,21.84 20.85,24.24 v20.85,25.15
  other vias: 2.54,35.56 7.98,22.07 23.7,35.41 25.32,35.92
  pour Top (isolate 0.254): 35.1,38.1 3,38.1 arc90 0,35.1 0,3 arc90 3,0 35.1,0 arc90 38.1,3 38.1,35.1 arc90
  pour Bottom (isolate 0.254): 35.1,38.1 3,38.1 arc90 0,35.1 0,3 arc90 3,0 35.1,0 arc90 38.1,3 38.1,35.1 arc90
GSM_PWR_ON  (via drill 0.3 pad 0.5, 0.9 pad 1.7)
  Top 0.25: v24.4,20.15 24.6,19.95 25.45,19.95 26.05,20.55 ATMEGA2.91
  Bottom 0.25: v35.56,27.94 34.32,26.7 31.69,26.7 31.13,26.14 31.13,23.82 27.19,19.88 24.67,19.88 v24.4,20.15
N$1
  Top 0.152: 11.03,21.03 ATMEGA2.34
  Top 0.25: 11.03,21.03 11.01,21.05 10.21,21.05 9.82,20.66 9.82,19.39 9.54,19.11 ZQ1.3
N$2
  Top 0.25: ATMEGA2.33 9.65,21.55 9.42,21.32 8.53,21.32 ZQ1.1
N$3
  Top 0.152: L.2 30.56,35.12 R1.2
N$4
  Top 0.25: IC1.9 22.44,35.67 22.1,36.02 19.74,36.02 18.96,36.79 R4.1
N$10
  Top 0.152: PWR.2 R2.2
N$11  (via drill 2 pad 2.8)
  other vias: 35.88,2.22
N$12  (via drill 2 pad 2.8)
  other vias: 2.22,2.22
RST  (via drill 0.35, 0.9 pad 1.7)
  Top 0.25: 10.97,23.02 10.99,23.05 ATMEGA2.30 9.6,23.05 R3.1 8.71,24 9.73,25.02 9.73,26.48 9.4,26.81 4.38,26.81 3.85,27.35 3.85,30.89 3,31.74 1.87,31.74 1.26,32.35 1.26,33.56 1.97,34.27 3.18,34.27 3.83,34.92 3.83,36.23 4.43,36.84 6.07,36.84 8.05,34.86 18.93,34.86 v19.18,35.1 | 33.56,29.3 31.49,29.3 31.19,29.6 27.55,29.6 C4.1 | v36.86,23.75 36.86,23.72 36.83,23.7
  Top 0.254: v33.02,15.24 34.29,16.51 36.32,16.51 36.83,17.02 36.83,23.7 36.83,26.1 36.26,26.67 34.92,26.67 34.29,27.31 34.29,28.58 33.56,29.3
  Bottom 0.25: v36.86,23.75 36.86,23.93 37.36,24.44 37.36,35.76 36.03,37.1 31.42,37.1 29.68,35.36 26.93,35.36 25.49,36.8 20.26,36.8 19.18,35.71 v19.18,35.1
RX0  (via drill 0.3 pad 0.5, 0.35, 0.9 pad 1.7)
  Top 0.25: ATMEGA2.2 24.55,28.15 v24.73,28.32 | v23.25,28.32 23.03,28.54 9.29,28.54 | 3.81,31.75 v2.54,33.02 | IC1.25 21.44,30.15 20.95,29.67 v20.45,29.67
  Top 0.254: 9.29,28.54 6.08,31.75 3.81,31.75
  Bottom 0.25: v24.73,28.32 v24.72,28.32 v23.25,28.32 23.02,28.55 21.56,28.55 v20.45,29.67
RX1  (via drill 0.9 pad 1.7)
  Top 0.25: ATMEGA2.45 9.65,15.55 5.53,11.43 3.81,11.43 v2.54,10.16
RX2  (via drill 0.3 pad 0.5, 0.9 pad 1.7)
  Top 0.25: ATMEGA2.12 19.55,25.35 21.15,23.75 21.15,23 20.65,22.5 17.35,22.5 | v6.95,16.85 6.35,16.45 6.35,14.7 5.6,13.95 3.79,13.95 v2.54,12.7
  Top 0.254: 13.77,22.4 v13.57,22.4 14.17,22.4 14.31,22.27 17.12,22.27 17.35,22.5
  Bottom 0.25: 12,22.15 7.15,17.3 7.15,17.05 v6.95,16.85
  Bottom 0.254: 12,22.15 12.25,22.4 v13.57,22.4
RX3  (via drill 0.3 pad 0.5, 0.9 pad 1.7)
  Top 0.25: ATMEGA2.63 19.05,12.1
  Top 0.254: 19.05,12.1 18.82,12.33 v18.82,12.65
  Bottom 0.25: 16.95,13.45 17.3,13.1 | 15,14.45 6.25,14.45 5.8,14 5.8,13.99 5.76,13.95 3.83,13.95 v2.54,15.24
  Bottom 0.254: 17.3,13.1 17.75,12.65 v18.82,12.65 | 15,14.45 15.43,14.45 16.33,13.55 16.85,13.55 16.95,13.45
RX_GSM_H  (via drill 0.9 pad 1.7)
  Top 0.25: v35.56,17.78 34.29,19.05 32.4,19.05 29.9,16.55 ATMEGA2.83
SCL  (via drill 0.3 pad 0.5, 0.9 pad 1.7)
  Top 0.25: ATMEGA2.43 12.2,16.55 12.8,15.95 12.8,12.5 11.85,11.55 v8.65,11.55
  Bottom 0.25: 8.45,11.55 v8.65,11.55
  Bottom 0.305: v8.65,11.55 7.74,11.55 6.51,10.32 6.51,7.34 5.58,6.41 3.75,6.41 v2.54,7.62
SDA  (via drill 0.9 pad 1.7)
  Top 0.25: ATMEGA2.44 11.95,16.05 12.25,15.75 12.25,12.7 11.95,12.4 8.15,12.4 6.35,10.6 6.35,8.89 v5.08,7.62
TX0  (via drill 0.9 pad 1.7)
  Top 0.25: ATMEGA2.3 24.05,28.85 23.93,28.97 21.21,28.97 | IC1.26 21.93,29.69 21.21,28.97 | 21.21,28.97 9.52,28.97
  Top 0.254: v5.08,33.02 5.1,33 5.49,33 9.52,28.97
TX1  (via drill 0.9 pad 1.7)
  Top 0.25: v5.08,10.16 5.08,10.18 5.13,10.18 9.6,14.65 9.6,14.7 9.95,15.05 ATMEGA2.46
TX2  (via drill 0.3 pad 0.5, 0.9 pad 1.7)
  Top 0.25: ATMEGA2.13 19.05,25.1 19.4,24.75 19.4,24.55 20.05,23.9 v20.05,23.65 | v7.15,15.85 7.15,14.5 5.35,12.7 v5.08,12.7
  Top 0.254: v21.22,21.25 21.05,21.08 12.77,21.08 v12.55,21.3
  Bottom 0.25: 20.2,23.5 v20.05,23.65 | v12.55,21.3 12.4,21.3 12.4,21.1 v7.15,15.85
  Bottom 0.254: v20.05,23.65 21.22,22.48 v21.22,21.25
TX3  (via drill 0.3 pad 0.5, 0.9 pad 1.7)
  Top 0.254: ATMEGA2.64 19.55,12.44 19.76,12.65 v20.84,12.65
  Bottom 0.25: 5.14,15.3 v5.08,15.24 5.27,15.05 15.4,15.05 16.5,13.95 17.3,13.95
  Bottom 0.254: 17.3,13.95 17.8,13.45 20.29,13.45 20.84,12.9 v20.84,12.65
TX_GSM_H  (via drill 0.9 pad 1.7)
  Top 0.25: ATMEGA2.82 31.29,16.05 v33.02,17.78
VUSB
  Top 0.152: J1.B4_A9 11,31.63 | J1.A4_B9 15.72,31.68
  Top 0.25: 11,31.63 11,30.78 11.7,30.09 SCHOTTKY2.A 14.78,30.09 15.72,31.02 15.72,31.68

### Text on the board
tPlace: GND | C6 | 5V | A1 | A0 | RX0 | C5 | R2 | R1 | A2 | TX0 | A3 | 3 | . | 2 | C4 | C8 | C2 | A5 | A4 | D1 | 5 | 4 | A6 | A7 | 7 | A8 | 6 | A8 | 9 | A10 | 8 | A10 | 11 | A12 | 10 | 13 | A12 | ZQ1 | A15 | 12 | RX3 | A14 | AREF | RX2 | TX3 | C1 | C3 | RST | 53 | TX2 | 52 | RX1 | 51 | TX1 | 50 | SCL | 49 | SDA | 48 | 23 | 22 | 25 | 27 | 29 | 31 | 33 | 35 | 37 | 39 | 41 | 43 | 46 | 47 | 24 | 26 | 28 | 30 | 32 | 34 | 36 | 38 | 40 | 42 | 44 | 45